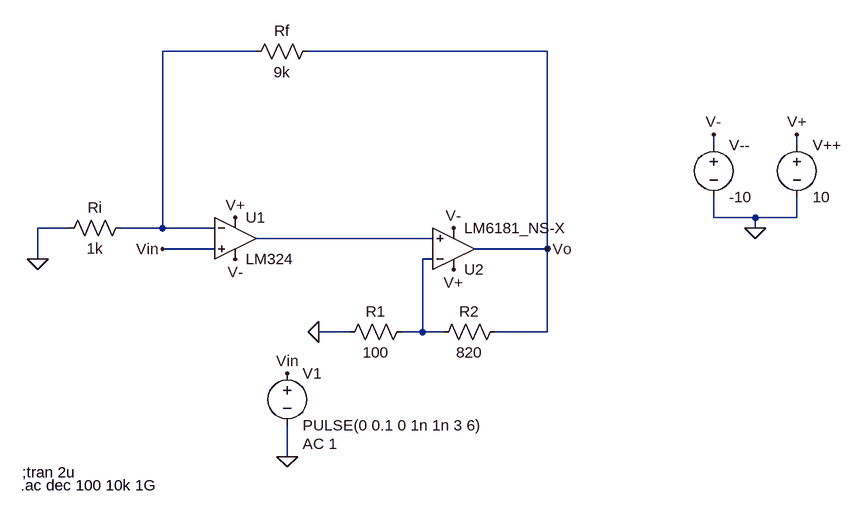
[diagram p0: schematic Lab3Circ2.asc]
Lab3Circ2.asc, the LTspice schematic file:
Version 4
SHEET 1 2140 680
WIRE 240 -128 96 -128
WIRE 688 -128 320 -128
WIRE 944 16 944 0
WIRE 1072 16 1072 0
WIRE 944 128 944 96
WIRE 1008 128 944 128
WIRE 1072 128 1072 96
WIRE 1072 128 1008 128
WIRE -48 144 -96 144
WIRE 96 144 96 -128
WIRE 96 144 32 144
WIRE 176 144 96 144
WIRE 1008 144 1008 128
WIRE 512 160 240 160
WIRE 176 176 96 176
WIRE 688 176 688 -128
WIRE 688 176 576 176
WIRE -96 192 -96 144
WIRE 512 192 496 192
WIRE 384 304 336 304
WIRE 496 304 496 192
WIRE 496 304 464 304
WIRE 528 304 496 304
WIRE 688 304 688 176
WIRE 688 304 608 304
WIRE 288 496 288 448
FLAG 1008 144 0
FLAG -96 192 0
FLAG 1072 0 V+
FLAG 208 128 V+
FLAG 944 0 V-
FLAG 208 192 V-
FLAG 288 496 0
FLAG 288 368 Vin
FLAG 544 144 V-
FLAG 544 208 V+
FLAG 688 176 Vo
FLAG 336 304 0
FLAG 96 176 Vin
SYMBOL LM324 208 96 R0
SYMATTR InstName U1
SYMBOL voltage 1072 0 R0
WINDOW 123 0 0 Left 0
WINDOW 39 24 124 Left 2
SYMATTR InstName V++
SYMATTR Value 10
SYMBOL voltage 944 0 R0
WINDOW 123 0 0 Left 0
WINDOW 39 24 124 Left 2
SYMATTR InstName V--
SYMATTR Value -10
SYMBOL res 48 128 R90
WINDOW 0 0 56 VBottom 2
WINDOW 3 32 56 VTop 2
SYMATTR InstName Ri
SYMATTR Value 1k
SYMBOL voltage 288 352 R0
WINDOW 123 24 124 Left 2
WINDOW 39 24 124 Left 2
SYMATTR Value2 AC 1
SYMATTR InstName V1
SYMATTR Value PULSE(0 0.1 0 1n 1n 3 6)
SYMBOL res 336 -144 R90
WINDOW 0 0 56 VBottom 2
WINDOW 3 32 56 VTop 2
SYMATTR InstName Rf
SYMATTR Value 9k
SYMBOL res 480 288 R90
WINDOW 0 0 56 VBottom 2
WINDOW 3 32 56 VTop 2
SYMATTR InstName R1
SYMATTR Value 100
SYMBOL res 624 288 R90
WINDOW 0 0 56 VBottom 2
WINDOW 3 32 56 VTop 2
SYMATTR InstName R2
SYMATTR Value 820
SYMBOL AutoGenerated\\LM6181_NS-X 544 176 M180
SYMATTR InstName U2
TEXT -120 520 Left 2 !;tran 2u
TEXT -122 540 Left 2 !.ac dec 100 10k 1G

The netlist it stands for:
* Lab3Circ2.asc
* U1: LM324 (symbol LM324 not available, pins judged from their places): In+=Vin In-=N001 V+=V+ V-=V- OUT=N002
V++ V+ 0 10
V-- V- 0 -10
Ri N001 0 1k
V1 Vin 0 PULSE(0 0.1 0 1n 1n 3 6) AC 1
Rf Vo N001 9k
R1 N003 0 100
R2 Vo N003 820
* U2: LM6181_NS-X (symbol AutoGenerated\LM6181_NS-X not available, pins judged from their places): In+=N002 In-=N003 V+=V+ V-=V- OUT=Vo
;tran 2u
.ac dec 100 10k 1G
.backanno
.end